# EAGLE design WZ4827R043-ESP32-V1.1-20230322 (EAGLE 9.5.1)
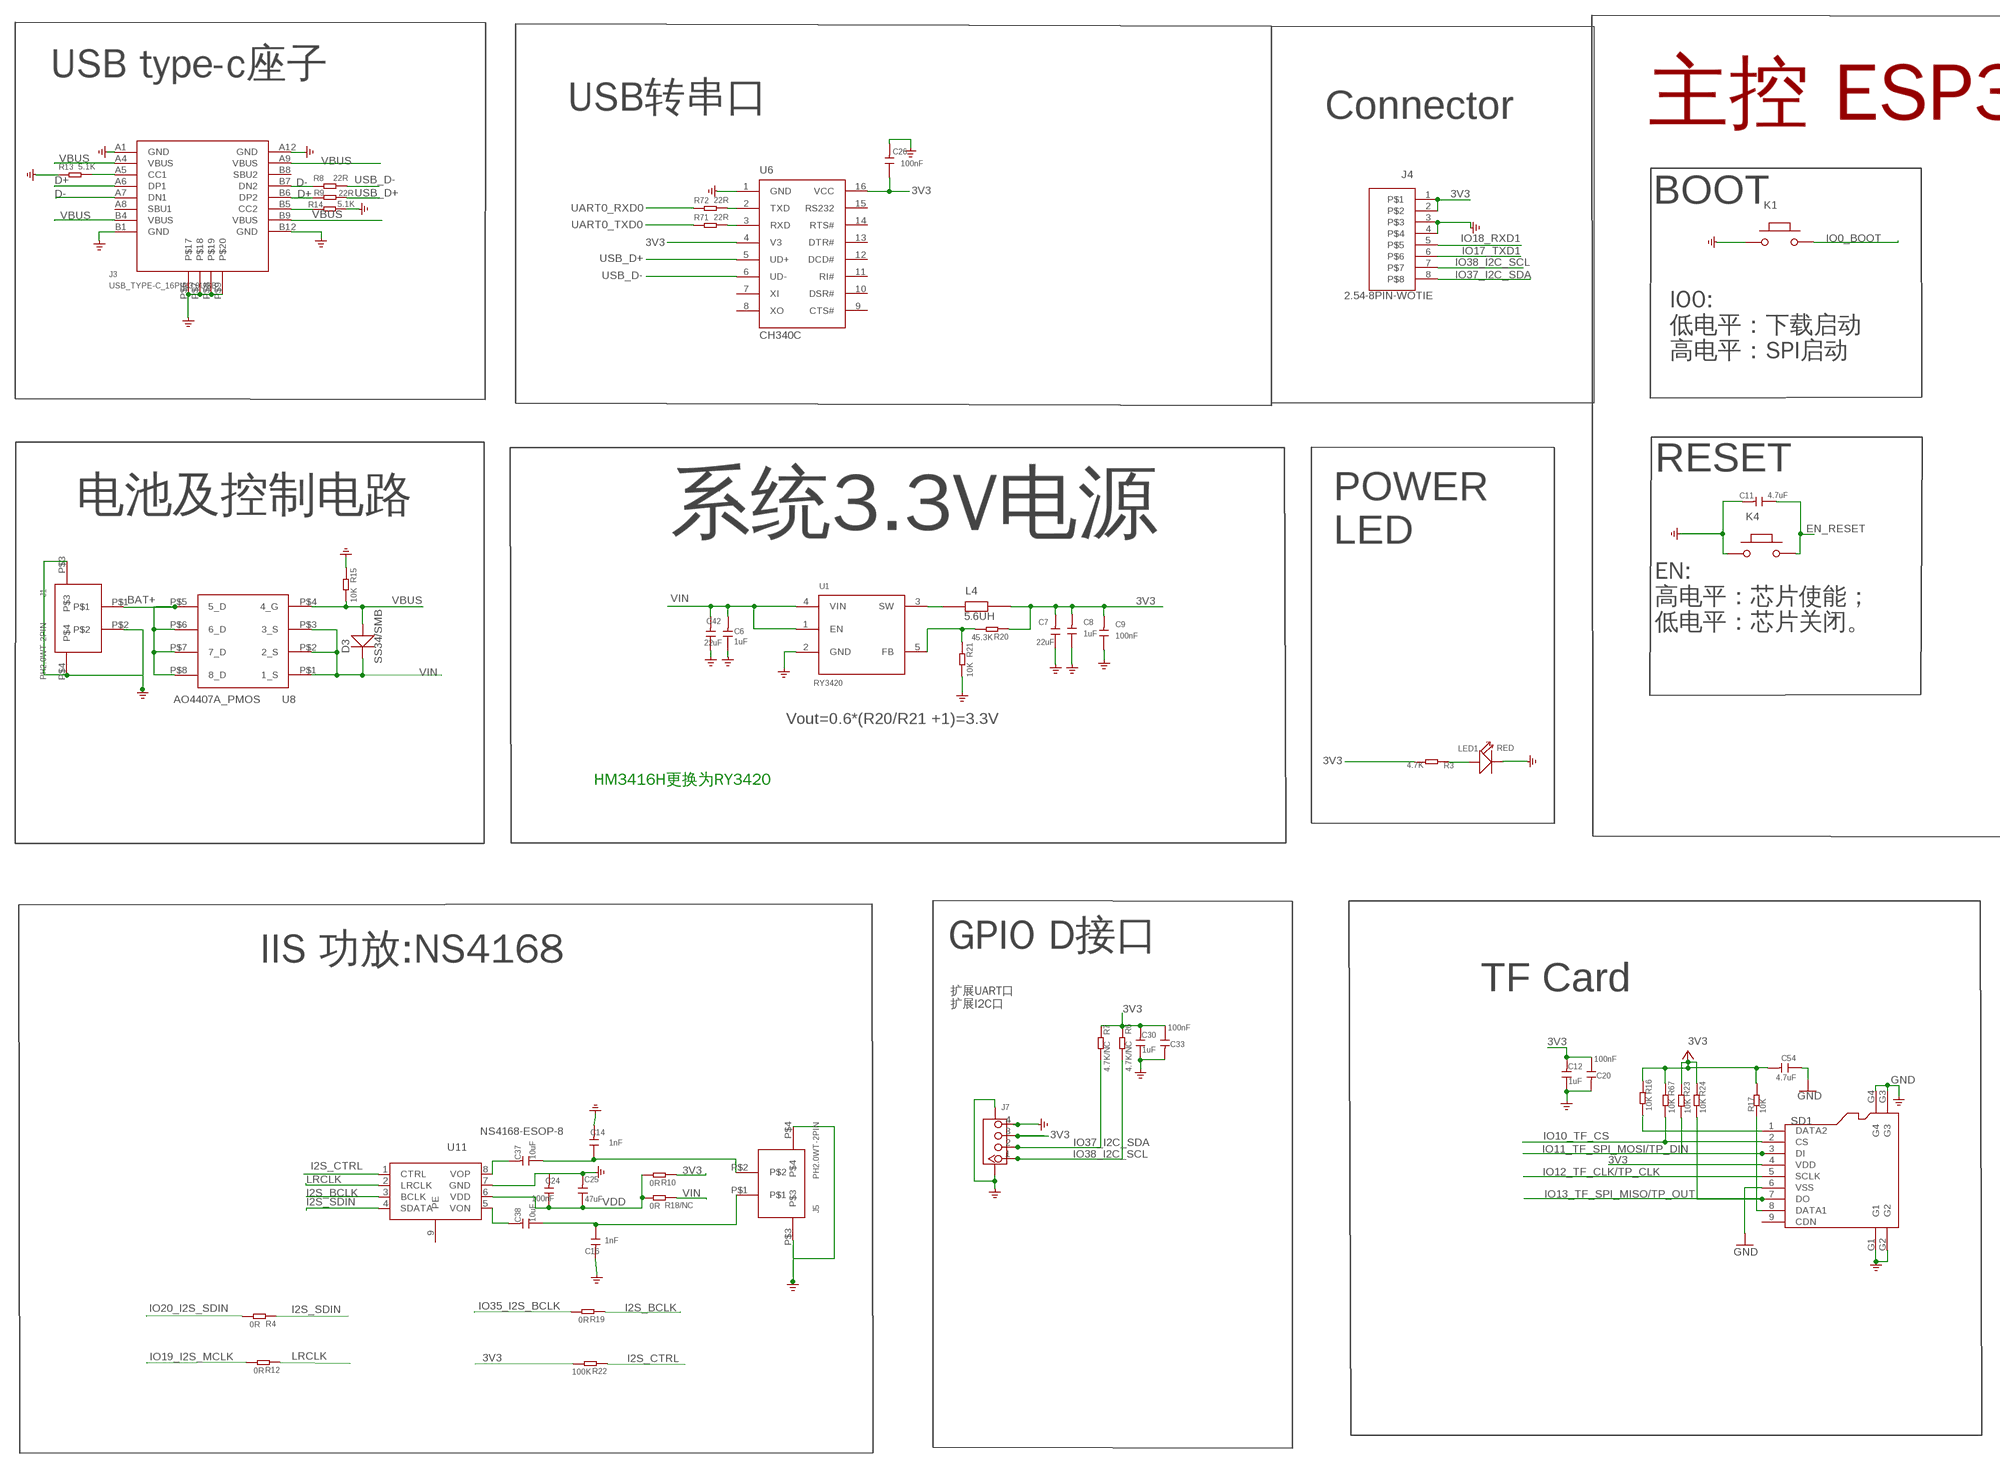
[diagram p0: schematic, sheet 1, part 1 of 2]
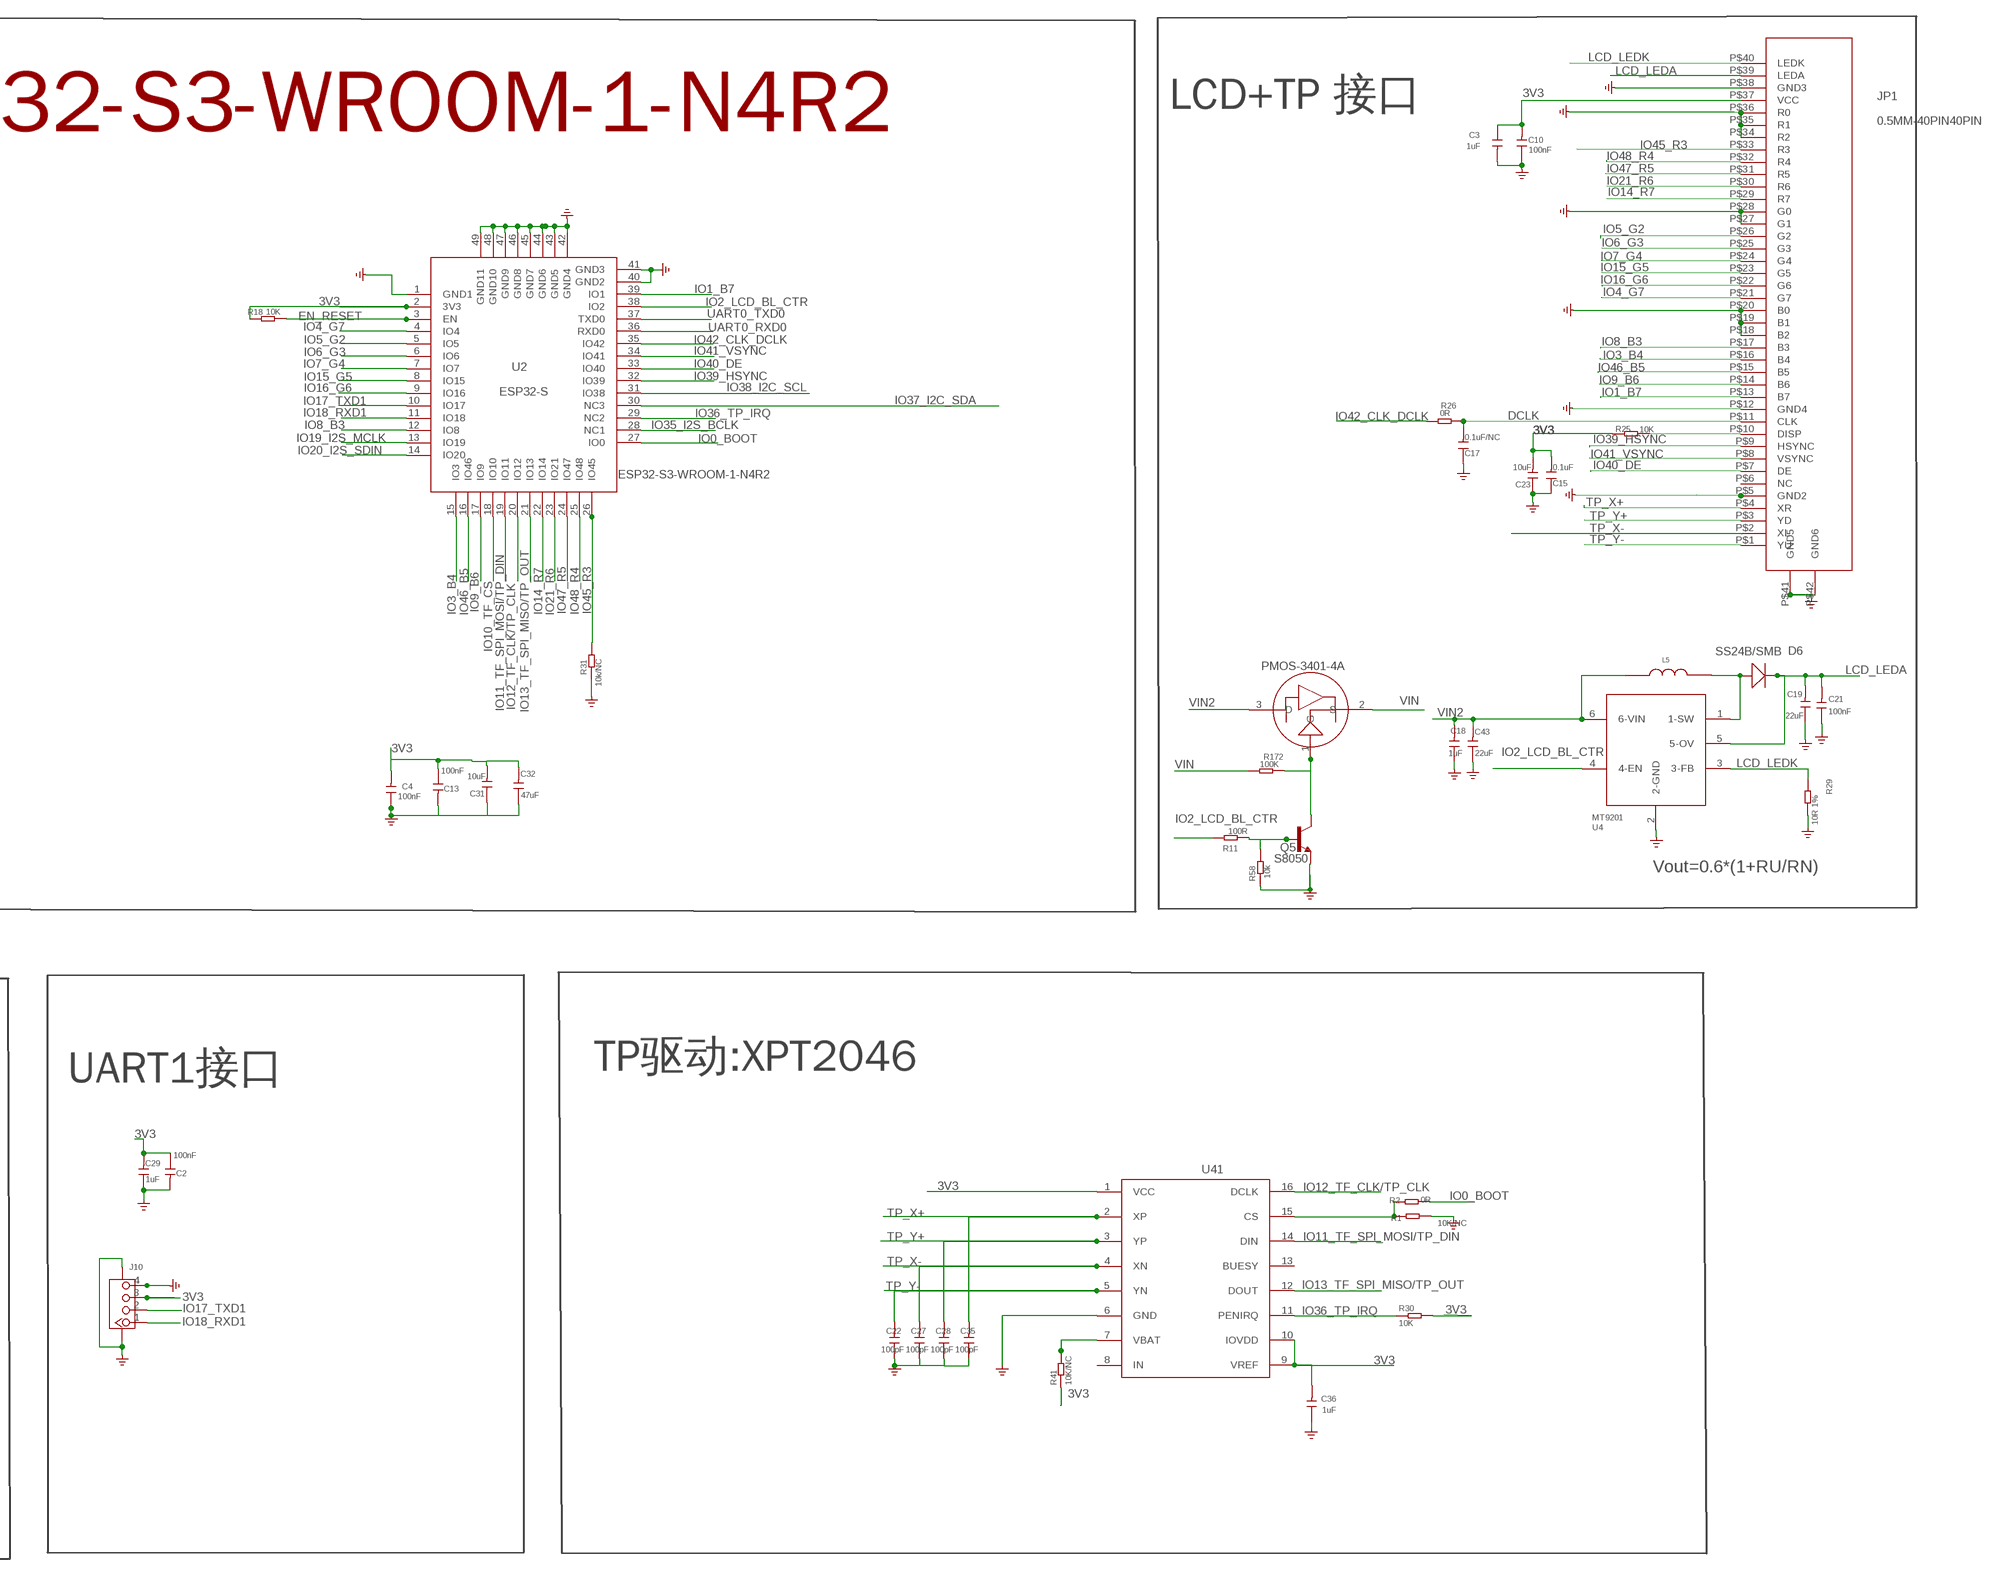
[diagram p1: schematic, sheet 1, part 2 of 2]

## Parts
C2  100nF  C-0603  [C0603]
C3  1uF  C-0603  [C0603]
C4  100nF  C-0603  [C0603]
C6  1uF  C0603  [0603]
C7  22uF  C0805  [0805]
C8  1uF  C0603  [0603]
C9  100nF  C0603  [0603]
C10  100nF  C-0603  [C0603]
C11  4.7uF  C0603  [0603]
C12  1uF  DISCRETE_C-0603  [DISCRETE_C0603]
C13  100nF  C-0603  [C0603]
C14  1nF  C-0603  [C0603]
C15  0.1uF  DISCRETE_C-0603  [DISCRETE_C0603]
C16  1nF  C-0603  [C0603]
C17  0.1uF/NC  DISCRETE_C-0603  [DISCRETE_C0603]
C18  1uF  C0603  [0603]
C19  22uF  C0805  [0805]
C20  100nF  C-0603  [C0603]
C21  100nF  C0603  [0603]
C22  100pF  C0603  [0603]
C23  10uF  DISCRETE_C-0603  [DISCRETE_C0603]
C24  100nF  C-0603  [C0603]
C25  47uF  C0805  [0805]
C26  100nF  C0603  [0603]
C27  100pF  C0603  [0603]
C28  100pF  C0603  [0603]
C29  1uF  DISCRETE_C-0603  [DISCRETE_C0603]
C30  1uF  DISCRETE_C-0603  [DISCRETE_C0603]
C31  10uF  DISCRETE_C-0603  [DISCRETE_C0603]
C32  47uF  C0805  [0805]
C33  100nF  C-0603  [C0603]
C35  100pF  C0603  [0603]
C36  1uF  DISCRETE_C-0603  [DISCRETE_C0603]
C37  10uF  DISCRETE_C-0603  [DISCRETE_C0603]
C38  10uF  DISCRETE_C-0603  [DISCRETE_C0603]
C42  22uF  C0805  [0805]
C43  22uF  C0805  [0805]
C54  4.7uF  DISCRETE_C-0603  [DISCRETE_C0603]
D3  SS34/SMB  214ABDO-214AB  [214AB]
D6  SS24B/SMB  214ABDO-214AB  [214AB]
J1  PH2.0WT-2PIN  [PH2.0WT-2PIN]
J3  USB_TYPE-C_16PIN3.0USB  [KEVIN_3.0TYPEC-SMD]
J4  2.54-8PIN-WOTIE  [2.54-8P-WOTIE]
J5  PH2.0WT-2PIN  [PH2.0WT-2PIN]
J7  CONNECTOR_TWIG-4P-2.0-SMD-FEMALE-REINFORCE90D  [CONNECTOR_4P-SMD-2.0-90D]
J10  CONNECTOR_TWIG-4P-2.0-SMD-FEMALE-REINFORCE90D  [CONNECTOR_4P-SMD-2.0-90D]
JP1  0.5MM-40PIN40PIN  [0.5MM*40P]
K1  BUTTON  PB157  [157SW]
K4  BUTTON  PB157  [157SW]
L4  5.6UH  CROWPI2-MB-V1.4-20211012_CMP201209UD1R0MT  [CD54]
L5  CD32_6.8uH  CD32_950MA  [CD32]
LED1  RED  DISCRETE_LED0603  [DISCRETE_LED-0603]
Q5  S8050  SPARKFUN_TRANSISTOR_NPNSOT23  [SPARKFUN_SOT23]
Q30  PMOS-3401-4A  P-MOS-SOT23  [SOT-23]
R1  10K/NC  R0603  [R0603]
R2  0R  DISCRETE_R-0603  [DISCRETE_R0603]
R3  4.7K  DISCRETE_R-0603  [DISCRETE_R0603]
R4  0R  DISCRETE_R-0603  [DISCRETE_R0603]
R6  4.7K/NC  DISCRETE_R-0603  [DISCRETE_R0603]
R7  4.7K/NC  DISCRETE_R-0603  [DISCRETE_R0603]
R8  22R  DISCRETE_R-0603  [DISCRETE_R0603]
R9  22R  DISCRETE_R-0603  [DISCRETE_R0603]
R10  0R  DISCRETE_R-0603  [DISCRETE_R0603]
R11  100R  R0603  [R0603]
R12  0R  DISCRETE_R-0603  [DISCRETE_R0603]
R13  5.1K  DISCRETE_R-0603  [DISCRETE_R0603]
R14  5.1K  DISCRETE_R-0603  [DISCRETE_R0603]
R15  10K  DISCRETE_R-0603  [DISCRETE_R0603]
R16  10K  DISCRETE_R-0603  [DISCRETE_R0603]
R17  10K  DISCRETE_R-0603  [DISCRETE_R0603]
R18  10K  DISCRETE_R-0603  [DISCRETE_R0603]
R18/NC  0R  DISCRETE_R-0603  [DISCRETE_R0603]
R19  0R  DISCRETE_R-0603  [DISCRETE_R0603]
R20  45.3K  DISCRETE_R-0603  [DISCRETE_R0603]
R21  10K  DISCRETE_R-0603  [DISCRETE_R0603]
R22  100K  DISCRETE_R-0603  [DISCRETE_R0603]
R23  10K  DISCRETE_R-0603  [DISCRETE_R0603]
R24  10K  DISCRETE_R-0603  [DISCRETE_R0603]
R25  10K  DISCRETE_R-0603  [DISCRETE_R0603]
R26  0R  R-0603  [R0603]
R29  10R 1%  DISCRETE_R-0603  [DISCRETE_R0603]
R30  10K  DISCRETE_R-0603  [DISCRETE_R0603]
R31  10k/NC  R0603  [R0603]
R41  10K/NC  DISCRETE_R-0603  [DISCRETE_R0603]
R58  10k  R0603  [R0603]
R67  10K  DISCRETE_R-0603  [DISCRETE_R0603]
R71  22R  DISCRETE_R-0603  [DISCRETE_R0603]
R72  22R  DISCRETE_R-0603  [DISCRETE_R0603]
R172  100K  R-0603  [R0603]
SD1  HOLDER-MICROSD-9P  [9P-SMD-W/-RING]
U1  RY3420  A_XBJ_HM3420B  [A_XBJ_SOT23-5]
U2  ESP32-S  [ESP32-S3]
U4  MT9201  [SOT23-6]
U6  CH340C  CH340G  [SOP-16]
U8  AO4407A_PMOS  T_PMOS_AO4407A_SOP8  [SOP8]
U11  NS4168-ESOP-8  [NS4168-ESOP-8]
U41  XPT2046  XP2046  [XP2046-SSOP16]

## Nets
3V3: C2.1 C3.1 C4.2 C7.2 C8.2 C9.2 C10.2 C12.2 C13.1 C15.2 C20.1 C23.2 C26.1 C29.2 C30.2 C31.2 C32.2 C33.1 C36.2 C54.2 J4.1 J4.2 J7.3 J10.3 JP1.P$37(VCC) L4.2 R3.2 R6.1 R7.1 R10.1 R16.1 R17.1 R18.1 R20.1 R22.2 R23.1 R24.1 R25.1 R30.2 R41.1 R67.1 SD1.4(VDD) U2.2(3V3) U6.4(V3) U6.16(VCC) U41.1(VCC) U41.9(VREF) U41.10(IOVDD) ; supply symbol labelled +3V3
BAT+: J1.P$1 U8.P$5(5_D) U8.P$6(6_D) U8.P$7(7_D) U8.P$8(8_D)
D+: J3.A6(DP1) J3.B6(DP2) R9.1
D-: J3.A7(DN1) J3.B7(DN2) R8.1
DCLK: C17.2 JP1.P$11(CLK) R26.2
EN_RESET: C11.1 K4.2 R18.2 U2.3(EN)
GND: C2.2 C3.2 C4.1 C6.1 C7.1 C8.1 C9.1 C10.1 C11.2 C12.1 C13.2 C14.2 C15.1 C16.2 C17.1 C18.1 C19.1 C20.2 C21.1 C22.1 C23.1 C24.2 C25.2 C26.2 C27.1 C28.1 C29.1 C30.1 C31.1 C32.1 C33.2 C35.1 C36.1 C42.1 C43.1 C54.1 J1.P$2 J1.P$3 J1.P$4 J3.A1(GND) J3.A12(GND) J3.B1(GND) J3.B12(GND) J3.P$6 J3.P$7 J3.P$8 J3.P$9 J4.3 J4.4 J5.P$3 J5.P$4 J7.4 J7.SS1 J7.SS2 J10.4 J10.SS1 J10.SS2 JP1.P$5(GND2) JP1.P$12(GND4) JP1.P$18(B2) JP1.P$19(B1) JP1.P$20(B0) JP1.P$27(G1) JP1.P$28(G0) JP1.P$34(R2) JP1.P$35(R1) JP1.P$36(R0) JP1.P$38(GND3) JP1.P$41(GND5) JP1.P$42(GND6) K1.1 K4.1 LED1.- Q5.2(E) R1.1 R13.1 R14.2 R15.1 R21.2 R29.2 R31.1 R58.1 SD1.6(VSS) SD1.G1 SD1.G2 SD1.G3 SD1.G4 U1.2(GND) U2.1(GND1) U2.40(GND2) U2.41(GND3) U2.42(GND4) U2.43(GND5) U2.44(GND6) U2.45(GND7) U2.46(GND8) U2.47(GND9) U2.48(GND10) U2.49(GND11) U4.2(2-GND) U6.1(GND) U11.7(GND) U41.6(GND)
I2S_BCLK: R19.1 U11.3(BCLK)
I2S_CTRL: R22.1 U11.1(CTRL)
I2S_SDIN: R4.1 U11.4(SDATA)
IO0_BOOT: K1.2 R2.1 U2.27(IO0)
IO1_B7: JP1.P$13(B7) U2.39(IO1)
IO2_LCD_BL_CTR: R11.2 U2.38(IO2) U4.4(4-EN)
IO3_B4: JP1.P$16(B4) U2.15(IO3)
IO4_G7: JP1.P$21(G7) U2.4(IO4)
IO5_G2: JP1.P$26(G2) U2.5(IO5)
IO6_G3: JP1.P$25(G3) U2.6(IO6)
IO7_G4: JP1.P$24(G4) U2.7(IO7)
IO8_B3: JP1.P$17(B3) U2.12(IO8)
IO9_B6: JP1.P$14(B6) U2.17(IO9)
IO10_TF_CS: R67.2 SD1.2(CS) U2.18(IO10)
IO11_TF_SPI_MOSI/TP_DIN: R23.2 SD1.3(DI) U2.19(IO11) U41.14(DIN)
IO12_TF_CLK/TP_CLK: SD1.5(SCLK) U2.20(IO12) U41.16(DCLK)
IO13_TF_SPI_MISO/TP_OUT: R24.2 SD1.7(DO) U2.21(IO13) U41.12(DOUT)
IO14_R7: JP1.P$29(R7) U2.22(IO14)
IO15_G5: JP1.P$23(G5) U2.8(IO15)
IO16_G6: JP1.P$22(G6) U2.9(IO16)
IO17_TXD1: J4.6 J10.2 U2.10(IO17)
IO18_RXD1: J4.5 J10.1 U2.11(IO18)
IO19_I2S_MCLK: R12.2 U2.13(IO19)
IO20_I2S_SDIN: R4.2 U2.14(IO20)
IO21_R6: JP1.P$30(R6) U2.23(IO21)
IO35_I2S_BCLK: R19.2 U2.28(NC1)
IO36_TP_IRQ: R30.1 U2.29(NC2) U41.11(PENIRQ)
IO37_I2C_SDA: J4.8 J7.2 R7.2 U2.30(NC3)
IO38_I2C_SCL: J4.7 J7.1 R6.2 U2.31(IO38)
IO39_HSYNC: JP1.P$9(HSYNC) U2.32(IO39)
IO40_DE: JP1.P$7(DE) U2.33(IO40)
IO41_VSYNC: JP1.P$8(VSYNC) U2.34(IO41)
IO42_CLK_DCLK: R26.1 U2.35(IO42)
IO45_R3: JP1.P$33(R3) R31.2 U2.26(IO45)
IO46_B5: JP1.P$15(B5) U2.16(IO46)
IO47_R5: JP1.P$31(R5) U2.24(IO47)
IO48_R4: JP1.P$32(R4) U2.25(IO48)
LCD_LEDA: C19.2 C21.2 D6.2(-) JP1.P$39(LEDA) U4.5(5-OV)
LCD_LEDK: JP1.P$40(LEDK) R29.1 U4.3(3-FB)
LRCLK: R12.1 U11.2(LRCLK)
N$1: LED1.+ R3.1
N$2: R41.2 U41.7(VBAT)
N$3: C37.2 U11.8(VOP)
N$6: C14.1 C37.1 J5.P$2
N$7: JP1.P$10(DISP) R25.2
N$9: R1.2 R2.2 U41.15(CS)
N$10: C16.1 C38.1 J5.P$1
N$11: J3.A5(CC1) R13.2
N$12: C38.2 U11.5(VON)
N$13: L4.1 U1.3(SW)
N$16: D6.1(+) L5.2 U4.1(1-SW)
N$17: J3.B5(CC2) R14.1
N$20: R20.2 R21.1 U1.5(FB)
N$23: Q5.1(B) R11.1 R58.2
N$36: Q5.3(C) Q30.1(G) R172.2
N$40: R72.2 U6.2(TXD)
N$42: R71.2 U6.3(RXD)
N$47: R16.2 SD1.1(DATA2)
N$48: R17.2 SD1.8(DATA1)
TP_X+: C35.2 JP1.P$4(XR) U41.2(XP)
TP_X-: C27.2 JP1.P$2(XL) U41.4(XN)
TP_Y+: C28.2 JP1.P$3(YD) U41.3(YP)
TP_Y-: C22.2 JP1.P$1(YU) U41.5(YN)
UART0_RXD0: R72.1 U2.36(RXD0)
UART0_TXD0: R71.1 U2.37(TXD0)
USB_D+: R9.2 U6.5(UD+)
USB_D-: R8.2 U6.6(UD-)
VBUS: D3.1(+) J3.A4(VBUS) J3.A9(VBUS) J3.B4(VBUS) J3.B9(VBUS) R15.2 U8.P$4(4_G)
VDD: C24.1 C25.1 R10.2 R18/NC.2 U11.6(VDD)
VIN: C6.2 C42.2 D3.2(-) Q30.2(S) R18/NC.1 R172.1 U1.1(EN) U1.4(VIN) U8.P$1(1_S) U8.P$2(2_S) U8.P$3(3_S)
VIN2: C18.2 C43.2 L5.1 Q30.3(D) U4.6(6-VIN)
Unconnected: J3.A8(SBU1) J3.B8(SBU2) JP1.P$6(NC) SD1.9(CDN) U6.7(XI) U6.8(XO) U6.9(CTS#) U6.10(DSR#) U6.11(RI#) U6.12(DCD#) U6.13(DTR#) U6.14(RTS#) U6.15(RS232) U11.9(PE) U41.8(IN) U41.13(BUESY)

## Notes on the sheet
- USB type-c座子
- USB转串口 | LCD+TP 接口
- Connector | 主控 ESP32-S3-WROOM-1-N4R2
- BOOT
- IO0:
  低电平：下载启动
  高电平：SPI启动
- RESET
- 电池及控制电路
- 系统3.3V电源
- POWER
  LED
- EN:
  高电平：芯片使能；
  低电平：芯片关闭。
- Vout=0.6*(R20/R21 +1)=3.3V
- HM3416H更换为RY3420
- Vout=0.6*(1+RU/RN)
- GPIO D接口
- IIS 功放:NS4168
- TF Card | UART1接口 | TP驱动:XPT2046
- 扩展UART口
  扩展I2C口

## Library data of the parts
C2-C4 C10 C13 C14 C16 C20 C24 C33 = discrete:C*: Ceramic Capacitors
C6 C8 C9 C11 C18 C21 C22 C26-C28 C35 = A_xbj:C0603
C7 C19 C25 C32 C42 C43 = A_xbj:C0805
C12 C29 C30 C36-C38 = A_xbj:DISCRETE_C*: Ceramic Capacitors
C15 C17 C23 C31 C54 = A9G:DISCRETE_C*: Ceramic Capacitors
D3 D6 = DO-214AB:214AB: 214AB
J1 J5 = cooper:PH2.0WT-2PIN
J3 = WZ3532R024-ESP32-V0.1-20221226:USB_TYPE-C_16PIN
J4 = cooper:2.54-8PIN-WOTIE
J7 J10 = A_xbj:CONNECTOR_TWIG-4P-2.0-SMD-FEMALE-REINFORCE
JP1 = cooper:0.5MM-40PIN
K1 K4 = MySMD:PB157
L4 = CD54:CROWPI2-MB-V1.4-20211012_CMP201209UD1R0MT
L5 = CD54:CD32_950MA
LED1 = A_xbj:DISCRETE_LED*
Q5 = Adafruit_HUZZAH32_ESP32_Feather:SPARKFUN_TRANSISTOR_NPN: Transistor NPN BJT configuration in SOT23 package. MMBT2222 is the common NPN we use. Double check BCE configuration again layout.
Q30 = DFN8:P-MOS-SOT23
R1 R11 R31 R58 = cooper:R0603
R2-R4 R6-R10 R12-R18 R18/NC R19-R25 R29 R67 R71 R72 = Crowtail-_LED-V2.0-20190615-01:DISCRETE_R*
R26 R172 = discrete:R*
R30 R41 = A9G:DISCRETE_R*
SD1 = Connector:HOLDER-MICROSD-9P
U1 = CrowBot_-V1.0-20220525:A_XBJ_HM3420B
U2 = DW1000:ESP32-S; U2: ESP32-S3-WROOM-1-N4R2
U4 = cooper:MT9201
U6 = A_xbj:CH340G
U8 = cooper:T_PMOS_AO4407A_SOP8
U11 = STC_MCUSTC8G1K08A:NS4168-ESOP-8
U41 = cooper:XP2046

## Net classes
0 GND: width 0.152 mm, drill 0.3 mm, clearance 0.152 mm

## Board
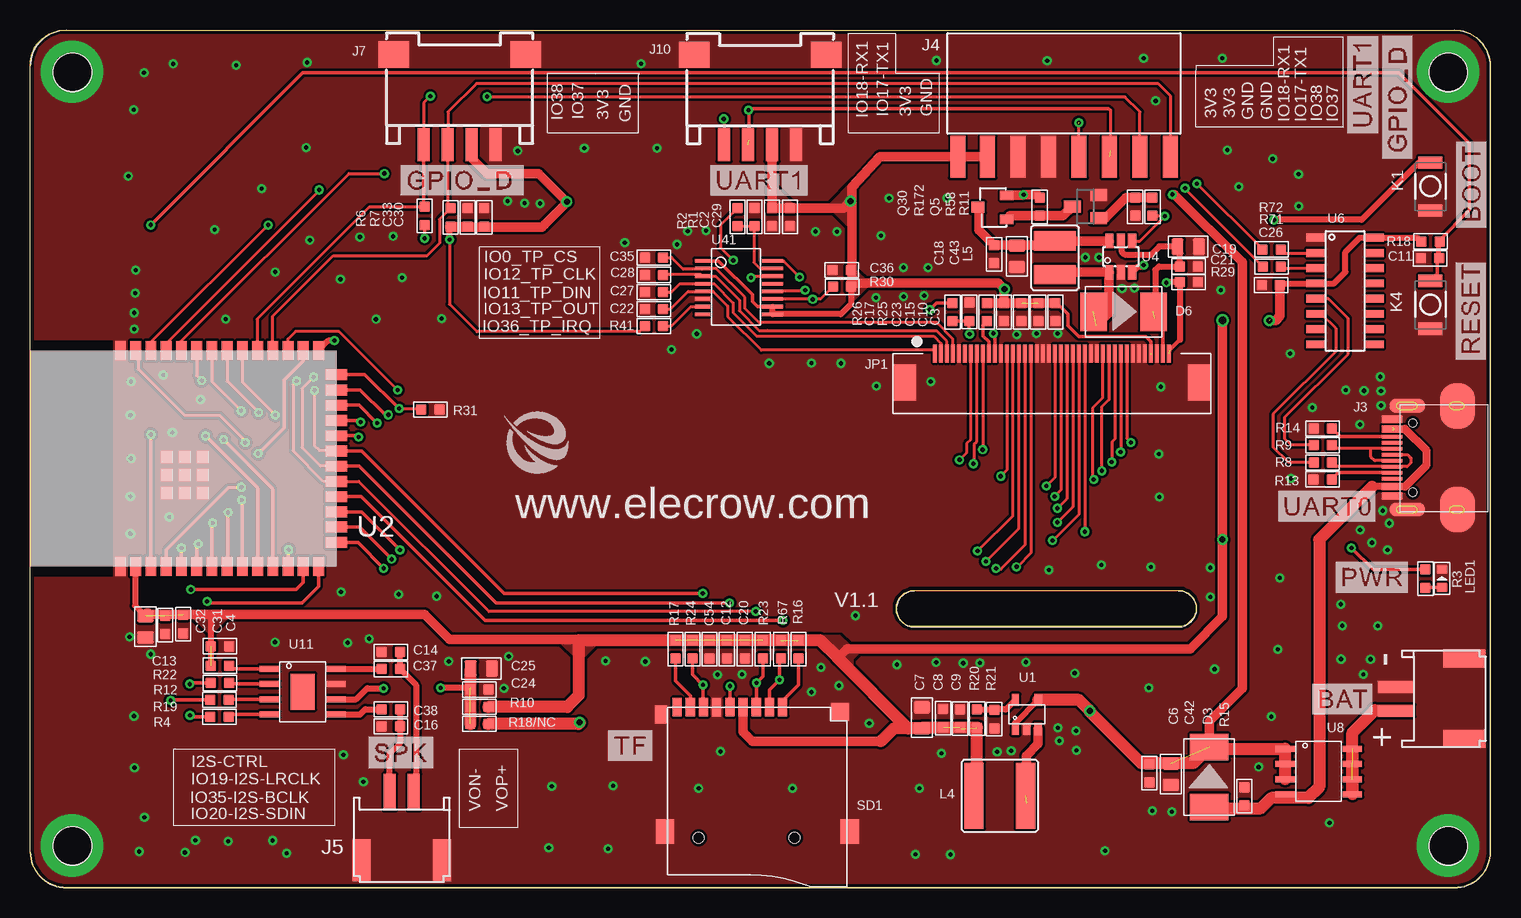
[diagram p2: board, top side]
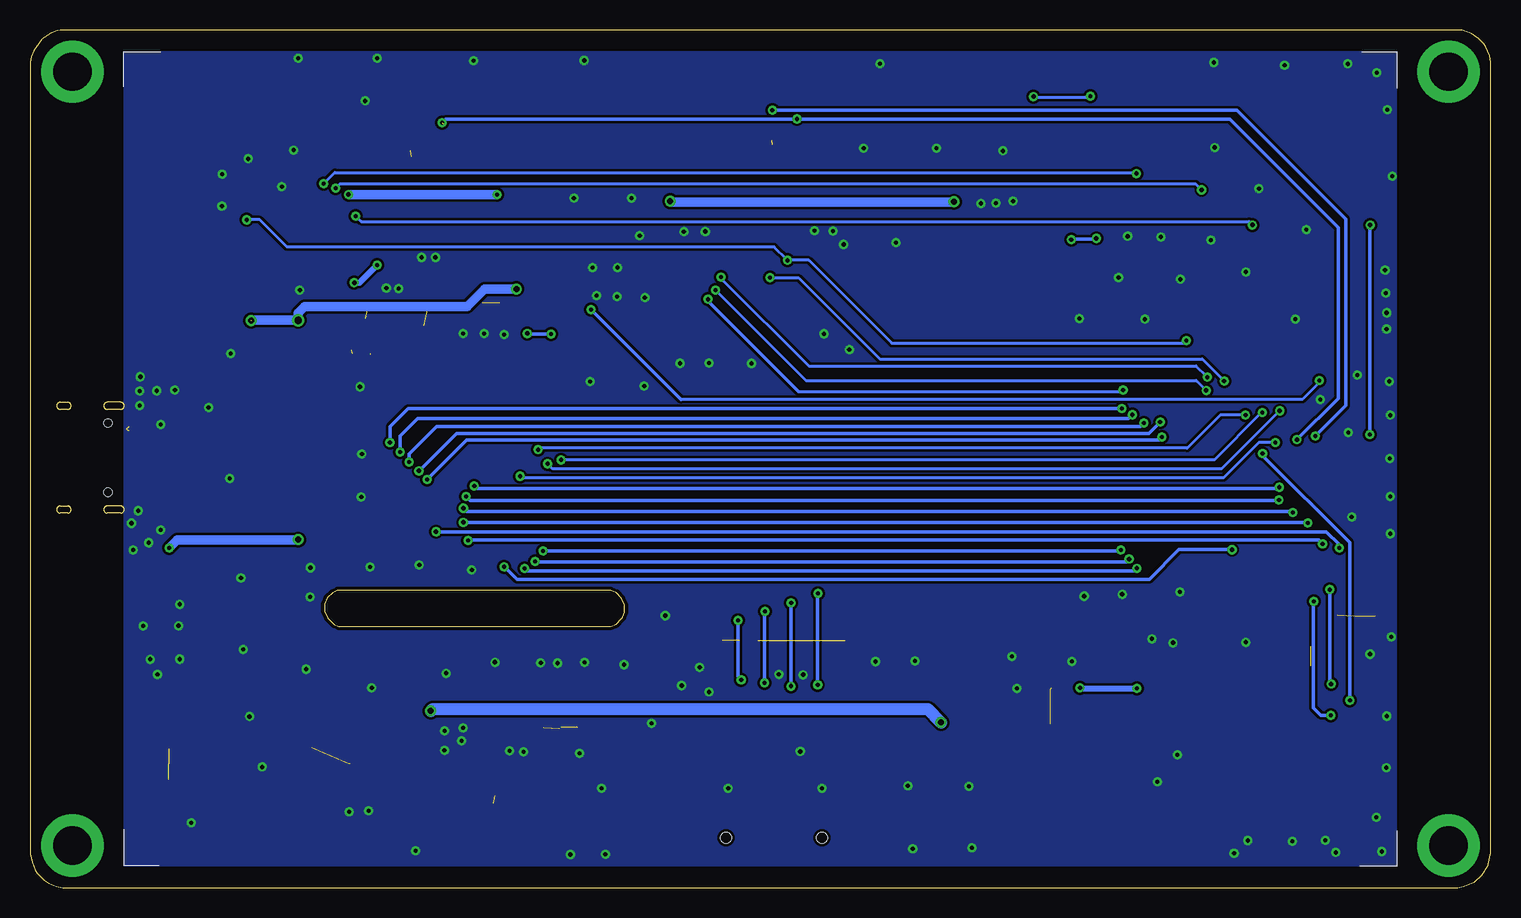
[diagram p3: board, bottom side, seen from below]

Size 121.74 x 71.5 mm. Coordinates in mm from the lower left corner, seen from the top.
Outline: 0,2.9 0,68.83 0.1,69.36 0.41,70.1 0.58,70.36 1.01,70.79 1.59,71.17 2.38,71.5 119.25,71.5 119.51,71.45 120.04,71.23 120.78,70.74 120.85,70.66 121.46,69.76 121.65,69.29 121.74,68.83 121.74,2.82 121.6,2.09 121.33,1.46 121.16,1.19 120.57,0.61 120.21,0.37 119.58,0.11 119.05,0 2.77,0 2.24,0.11 1.32,0.49 0.76,1.04 0.23,1.84 0.19,1.92 0,2.9
Outline: 96.03,21.77 73.36,21.77 72.92,21.95 72.49,22.38 72.38,22.54 72.21,22.95 72.21,23.55 72.44,24.1 72.89,24.56 73.4,24.76 96.11,24.76 96.55,24.58 97,24.14 97.21,23.63 97.21,23.03 96.98,22.48 96.43,21.93 96.03,21.77
Copper layers (1*16): Top 0.035mm / dielectric 1.5mm / Bottom 0.035mm
Design rules "default *": minimum track width 6mil, minimum drill 0.35mm, track to track 8mil, track to pad 7mil, pad to pad 7mil, via to via 8mil, smd to smd 8mil, copper to edge 10mil, drill to drill 8mil, minimum pad ring 10mil, minimum via ring 8mil, stop-mask expansion 4mil, vias tented up to drill 100mil, thermal gap 0mil

### Footprints (pad centres in the part's own frame; a part is rotated, then mirrored left to right if it is on the bottom)
C0603 = smd 0.889 x 0.889: 1 -0.762,0; 2 0.762,0
0603 = smd 0.889 x 0.889: 1 -0.762,0; 2 0.762,0
0805 = smd 1.016 x 1.397: 1 -0.889,0; 2 0.889,0
DISCRETE_C0603 = smd 0.889 x 0.889: 1 -0.762,0; 2 0.762,0
214AB = smd 2.2 x 3.2: 1 -2.5,0; 2 2.5,0
PH2.0WT-2PIN = smd 1 x 3: P$1 -1,0; P$2 1,0 | smd 1.5 x 3.5: P$3 -3.35,-5.7; P$4 3.35,-5.7
KEVIN_3.0TYPEC-SMD = smd 0.3 x 1.7: A1 -3.35,0.5; A4 -2.55,0.5; A5 -1.25,0.5; A6 -0.25,0.5; A7 0.25,0.5; A8 1.25,0.5; A9 2.55,0.5; A12 3.35,0.5; B1 3.05,0.5; B4 2.25,0.5; B5 1.75,0.5; B6 0.75,0.5; B7 -0.75,0.5; B8 -1.75,0.5; B9 -2.25,0.5; B12 -3.05,0.5 | smd 1.143 x 2.921: P$6 -4.318,-0.762; P$7 4.318,-0.762 | smd 3.81 x 2.921: P$8 -4.318,-4.953; P$9 4.318,-4.953 | hole 0.68: -2.89,-1.22; 2.89,-1.22
2.54-8P-WOTIE = smd 1.25 x 3.5: 1 -8.839,-4.572; 2 -6.35,-4.572; 3 -3.81,-4.572; 4 -1.27,-4.572; 5 1.27,-4.572; 6 3.81,-4.572; 7 6.35,-4.572; 8 8.89,-4.572
CONNECTOR_4P-SMD-2.0-90D = smd 1.01 x 2.74: 1 -3,-0.1; 2 -1,-0.1; 3 1,-0.1; 4 3,-0.1 | smd 2.54 x 2.184: SS1 -5.5,7.4; SS2 5.5,7.4
0.5MM*40P = smd 0.3 x 1.5: P$1 -8.81,1.73; P$2 -8.31,1.73; P$3 -7.81,1.73; P$4 -7.31,1.73; P$5 -6.81,1.73; P$6 -6.31,1.73; P$7 -5.81,1.73; P$8 -5.31,1.73; P$9 -4.81,1.73; P$10 -4.31,1.73; P$11 -3.81,1.73; P$12 -3.31,1.73; P$13 -2.81,1.73; P$14 -2.31,1.73; P$15 -1.81,1.73; P$16 -1.31,1.73; P$17 -0.81,1.73; P$18 -0.31,1.73; P$19 0.19,1.73; P$20 0.69,1.73; P$21 1.19,1.73; P$22 1.69,1.73; P$23 2.19,1.73; P$24 2.69,1.73; P$25 3.19,1.73; P$26 3.69,1.73; P$27 4.19,1.73; P$28 4.69,1.73; P$29 5.19,1.73; P$30 5.69,1.73; P$31 6.19,1.73; P$32 6.69,1.73; P$33 7.19,1.73; P$34 7.69,1.73; P$35 8.19,1.73; P$36 8.69,1.73; P$37 9.19,1.73; P$38 9.69,1.73; P$39 10.19,1.73; P$40 10.69,1.73 | smd 1.8 x 3: P$41 -11.31,-0.67; P$42 13.19,-0.67
157SW = smd 1.016 x 1.981: 1 0,0; 2 4,0
CD54 = smd 5.5 x 1.6: 1 0,2.159; 2 0,-2.159
CD32 = smd 3.5 x 1.6: 1 0,1.409; 2 0,-1.409
DISCRETE_LED-0603 = smd 0.762 x 0.889: + -0.762,0; - 0.762,0
SPARKFUN_SOT23 = smd 1 x 1.4: 1 -0.95,-1.1; 2 0.95,-1.1; 3 0,1.1
SOT-23 = smd 1.1 x 0.8: 1 1.2,-1; 2 1.2,1 | smd 1.1 x 0.9: 3 -1.2,0
R0603 = smd 0.889 x 0.889: 1 -0.762,0; 2 0.762,0
DISCRETE_R0603 = smd 0.889 x 0.889: 1 -0.762,0; 2 0.762,0
9P-SMD-W/-RING = smd 1.524 x 0.762: 1 0,4.4; 2 0,3.3; 3 0,2.2; 4 0,1.1; 5 0,0; 6 0,-1.1; 7 0,-2.2; 8 0,-3.3; 9 0,-4.4 | smd 1.524 x 1.016: G1 0.6,-5.746 | smd 2.032 x 1.524: G2 10.373,-5.4; G3 10.373,10 | smd 1.524 x 1.524: G4 0.392,9.181 | hole 0.889: 10.9,-2.6; 10.9,5.4
A_XBJ_SOT23-5 = smd 0.6 x 1: 1 -0.95,-1.2; 2 0,-1.2; 3 0.95,-1.2; 4 0.95,1.2; 5 -0.95,1.2
ESP32-S3 = smd 1.6 x 0.9: 1 0,18.01; 2 0,16.74; 3 0,15.47; 4 0,14.2; 5 0,12.93; 6 0,11.66; 7 0,10.39; 8 0,9.12; 9 0,7.85; 10 0,6.58; 11 0,5.31; 12 0,4.04; 13 0,2.77; 14 0,1.5; 27 18,1.5; 28 18,2.77; 29 18,4.04; 30 18,5.31; 31 18,6.58; 32 18,7.85; 33 18,9.12; 34 18,10.39; 35 18,11.66; 36 18,12.93; 37 18,14.2; 38 18,15.47; 39 18,16.74; 40 18,18.01 | smd 0.9 x 1.8: 15 2,0; 16 3.28,0; 17 4.55,0; 18 5.82,0; 19 7.09,0; 20 8.36,0; 21 9.63,0; 22 10.9,0; 23 12.17,0; 24 13.44,0; 25 14.71,0; 26 16,0 | smd 1 x 1: 41 7.64,11.16; 42 9.14,11.16; 43 6.14,11.16; 44 6.14,14.16; 45 7.64,12.66; 46 9.14,12.66; 47 7.64,14.16; 48 9.14,14.16; 49 6.14,12.66
SOT23-6 = smd 0.69 x 1.2: 1 -0.95,-1.3; 2 0,-1.3; 3 0.95,-1.3; 4 0.95,1.3; 5 0,1.3; 6 -0.95,1.3
SOP-16 = smd 0.66 x 1.5: 1 -4.445,-2.475; 2 -3.175,-2.475; 3 -1.905,-2.475; 4 -0.635,-2.475; 5 0.635,-2.475; 6 1.905,-2.475; 7 3.175,-2.475; 8 4.445,-2.475; 9 4.445,2.475; 10 3.175,2.475; 11 1.905,2.475; 12 0.635,2.475; 13 -0.635,2.475; 14 -1.905,2.475; 15 -3.175,2.475; 16 -4.445,2.475
SOP8 = smd 0.5 x 1.6: P$1 -1.905,-2.8; P$2 -0.635,-2.8; P$3 0.635,-2.8; P$4 1.905,-2.8; P$5 1.905,2.8; P$6 0.635,2.8; P$7 -0.635,2.8; P$8 -1.905,2.8
NS4168-ESOP-8 = smd 1.6 x 0.5: 1 -2.8,1.905; 2 -2.8,0.635; 3 -2.8,-0.635; 4 -2.8,-1.905; 5 2.8,-1.905; 6 2.8,-0.635; 7 2.8,0.635; 8 2.8,1.905 | smd 2 x 3: 9 0,0
XP2046-SSOP16 = smd 0.305 x 1.27: 1 -2.54,-2.54; 2 -1.905,-2.54; 3 -1.27,-2.54; 4 -0.635,-2.54; 5 0,-2.54; 6 0.635,-2.54; 7 1.27,-2.54; 8 1.905,-2.54 | smd 0.305 x 1.778: 9 1.905,3.302; 10 1.27,3.302; 11 0.635,3.302; 12 0,3.302; 13 -0.635,3.302; 14 -1.27,3.302; 15 -1.905,3.302; 16 -2.54,3.302

### Placement (x,y rotation side)
C2  61.85,55.91 270 top
C3  85.47,47.98 270 top
C4  12.78,21.97 90 top
C6  93.32,9.53 90 top
C7  74.36,14.15 270 top
C8  76.12,14.13 270 top
C9  77.54,14.1 270 top
C10  84.05,47.98 90 top
C11  116.72,52.47 180 top
C12  58.09,19.86 90 top
C13  15.82,20.12 0 top
C14  30.07,19.63 180 top
C15  82.63,47.98 90 top
C16  30.07,13.44 180 top
C17  78.31,48.01 270 top
C18  80.37,52.81 90 top
C19  96.55,53.44 180 top
C20  59.59,19.86 270 top
C21  96.6,51.79 180 top
C22  52.02,48.23 0 top
C23  81.18,47.98 90 top
C24  37.46,16.51 0 top
C25  37.62,18.26 0 top
C26  103.44,50.23 180 top
C27  52.02,49.66 0 top
C28  52.02,51.08 0 top
C29  63.35,55.91 90 top
C30  37.87,55.88 270 top
C31  11.28,21.89 90 top
C32  9.63,21.74 90 top
C33  36.47,55.88 90 top
C35  52.02,52.53 0 top
C36  67.67,51.49 0 top
C37  30.07,18.21 180 top
C38  30.07,14.86 180 top
C42  95.1,9.45 90 top
C43  82.27,52.63 90 top
C54  56.64,19.86 90 top
D3  98.3,9.21 90 top
D6  91.16,48.01 0 top
J1  113.87,15.75 90 top
J3  114.05,35.84 90 top
J4  86.18,65.51 0 top
J5  30.99,7.97 0 top
J7  35.81,62.05 0 top
J10  60.86,62.03 0 top
JP1  84.24,42.79 0 top
K1  116.74,56.44 90 top
K4  116.74,46.58 90 top
L4  80.85,7.65 270 top
L5  85.45,52.5 0 top
LED1  117.7,25.78 90 top
Q5  87.99,56.77 90 top
Q30  80.21,56.72 0 top
R1  60.4,55.91 270 top
R2  58.98,55.91 270 top
R3  116.33,25.76 90 top
R4  15.8,14.22 180 top
R6  32.89,56.01 90 top
R7  35.05,55.88 90 top
R8  107.76,35.44 180 top
R9  107.76,36.88 180 top
R10  37.46,15.06 180 top
R11  93.57,56.77 270 top
R12  15.82,17.04 180 top
R13  107.76,34.04 0 top
R14  107.76,38.27 180 top
R15  101.22,7.61 270 top
R16  64.06,19.86 270 top
R17  53.82,19.86 270 top
R18  116.74,53.87 0 top
R18/NC  37.46,13.64 180 top
R19  15.8,15.65 180 top
R20  78.96,14.08 90 top
R21  80.38,14.05 270 top
R22  15.82,18.49 180 top
R23  61.09,19.86 270 top
R24  55.22,19.86 270 top
R25  79.76,47.98 270 top
R26  76.91,47.98 270 top
R29  96.6,50.47 0 top
R30  67.69,50.09 0 top
R31  33.38,39.85 180 top
R41  52.02,46.81 0 top
R58  92.13,56.77 90 top
R67  62.61,19.86 270 top
R71  103.51,51.77 0 top
R72  103.49,53.2 0 top
R172  84.18,56.77 270 top
SD1  58.34,15.04 270 top
U1  83.09,14.43 0 top
U2  25.55,26.77 90 top
U4  90.93,52.6 0 top
U6  109.62,49.74 270 top
U8  107.43,9.68 270 top
U11  22.73,16.33 0 top
U41  58.6,49.71 270 top
U$10  [4.3底部丝印]  121.89,-0.05 0 bottom
U$30  [ELECROW-NEW]  39.45,34.52 0 top
U$33  [4.3板框]  -0.05,-0.28 0 top

### Tracks (layer width: path | path; a pad name or v marks a point on that pad's centre or on a via)
1
  cutout Top: 108.2,34.87 108.2,36.75 113.67,36.75 113.69,36.78 113.69,35.1 112.57,33.99 109.09,33.99
3V3  (via drill 0.35, 0.5, 0.6)  (14 unrouted)
  Top 0.152: C33.1 C30.2 | v44.75,57.18 44.75,57.12 42.9,55.27
  Top 0.203: 77.64,13.24 C9.2 77.51,13.37 | C8.2 76.14,13.34
  Top 0.254: v34.98,54.03 34.98,48.64 37.26,46.35 50.8,46.35 R41.1 | 115.67,54.18 R18.1 | R22.2 | 15.01,22.78 15.06,22.74 | C10.2 82.78,48.74 | R16.1 62.79,20.62
  Top 0.3: R3.2 111.96,26.52 v110.16,28.32 | JP1.P$37 93.43,44.6 93.43,44.61 | v34.98,54.03 34.98,55.07 | U41.1 57.4,52.25 60.22,49.42 60.22,48.87 60.65,48.44 U41.10 | C3.1 85.62,48.74 86.54,47.83 86.54,46.86 87.45,45.95 93.01,45.95 93.44,45.52 93.44,44.43 | SD1.4 59.44,13.76 | v32.89,54.13 R6.1
  Top 0.5: U2.2 8.76,26.72 8.76,23.49 C32.2 | R30.2 68.45,48.67 67.59,47.8 U41.9 U41.10 | v34.98,54.03 34.98,55.12 | C33.1 R7.1 | 115.67,54.18 U6.16 110.85,54.18 109.65,52.98 109.65,51.33 108.69,50.37 U6.4 104.35,50.37 C26.1 | 15.06,22.74 R22.2 | C2.1 C29.2
  Top 0.8: C26.1 104.2,47.64 103.83,47.27 v103.33,47.27 | C23.2 81.18,49.86 v81.23,49.91 80.75,50.39 68.76,50.39 R30.2 68.45,50.47 68.53,50.55 68.53,57.1 v68.4,57.23 | C23.2 R25.1 | C23.2 82.78,48.74 C3.1 85.48,48.73 | J10.3 61.85,61.92 C2.1 67.84,56.67 v68.4,57.23 | v68.4,57.23 68.53,57.35 68.53,58.4 70.85,60.93 J4.1 J4.2 | J7.3 36.75,61.89 36.75,60.86 38.1,59.51 42.39,59.51 44.77,57.14 42.9,55.27 42.7,55.07 34.98,55.07 | 70.93,12.19 60.25,12.19 59.44,13 SD1.4 | 67.34,19.13 68.12,19.91 96.72,19.91 99.42,22.61 v99.42,29.01 v99.42,47.29 | C33.1 34.98,55.12 | 9.78,22.78 15.01,22.78 32.88,22.78 34.96,20.7 45.82,20.7
  Top 1: L4.2 78.96,7.92 R20.1 74.41,13.31 C7.2 73.2,13.26 | 73.2,13.26 72,13.26 70.93,12.19 | 73.2,13.26 67.34,19.13 65.84,20.62 62.79,20.62 R17.1 45.75,20.62 45.75,16.03 44.78,15.06 R10.1 | C32.2 9.78,22.78
  Bottom 0.3: v103.33,47.27 103.33,47.37 | v32.89,54.13 32.97,54.05 34.98,54.05 v34.98,54.03
  Bottom 0.8: 103.38,47.29 v99.42,47.29 99.42,47.88 98.86,48.44 85.34,48.44 83.87,49.91 v81.23,49.91 | v110.16,28.32 109.5,28.98 99.44,28.98 v99.42,29.01 | v68.4,57.23 68.33,57.15 44.78,57.15 v44.75,57.18
  pour Top: 44.73,20.7 47.7,20.7 45.82,18.82 45.82,18.8 43.92,20.7
  pour Top: 13.97,22.91 16.94,22.91 15.06,21.03 15.06,21.01 13.16,22.91
  pour Top: 65.89,21.08 67.49,21.08 68.28,20.29 68.61,19.96 68.61,18.29 65.89,21.01 65.89,21.06
  pour Top (no thermals): 68.45,18.87 69.34,19.76 69.34,19.84 68.35,19.84 68.35,18.97
  pour Top (no thermals): 68.71,51.66 70.03,50.34 70.03,50.27 68.4,48.64 68.4,52.4 68.71,52.1
  pour Top (no thermals): 68.44,54.85 66.46,56.83 68.73,59.11 68.73,55.14
  pour Top: 63.25,56.57 62.15,56.57 62.15,58.47 64.06,56.57
BAT+  (2 unrouted)
  Top 1: U8.P$8 U8.P$5 110.23,12.91 112.1,14.78 J1.P$1
D+
  Top 0.254: J3.A6 112.11,35.59 111.79,35.92 111.79,36.59 | J3.B6 111.79,36.59 | 111.79,36.59 108.81,36.59 R9.1
D-
  Top 0.254: R8.1 108.88,35.09 J3.B7 114.79,35.09 115.11,35.41 115.11,35.81 114.84,36.09 J3.A7
DCLK  (via drill 0.35)
  Top 0.254: JP1.P$11 80.44,43.95
  Top 0.3: R26.2 76.94,47.24 C17.2 78.28,47.22 78.28,46.2 v78.33,46.15 | v80.31,46.2 80.44,46.08 80.44,43.95
  Bottom 0.3: v80.31,46.2 80.26,46.15 v78.33,46.15
EN_RESET  (via drill 0.35)
  Top 0.254: R18.2 117.33,53.7 | 117.33,53.8 117.33,53.7 | 117.33,53.7 117.33,52.2
  Top 0.3: U2.3 v10.08,37.77 | v10.06,55.24 22.73,67.92 114.12,67.92 119.99,62.05 119.99,56.46 117.48,53.95 | 117.48,53.95 C11.1 117.48,52.35 117.33,52.2 117.33,51.17 K4.2 | 117.48,53.95 117.33,53.8
  Bottom 0.3: v10.08,37.77 10.08,55.22 v10.06,55.24
GND  (via drill 0.35, 3.2 pad 5.2)
  Top 0.203: C42.1 94.71,8.95
  other vias: 118.22,68.03 3.51,68.03 3.51,3.51 118.22,3.51 74.87,51.68 31.02,50.84 105.77,56.8 93.43,26.74 12.92,2.92 89.62,3.06 16.3,47.39 68.82,22.67 76.73,2.75 70.95,54.36 76.43,57.49 8.64,64.86 75.54,18.78 93.28,16.65 25.87,50.72 110.87,38.6 55.74,8.27 8.3,20.89 99.41,69.16 49.59,53.77 8.2,59.3 8.68,47.92 93.55,6.39 102.42,10.05 9.1,3 8.71,10 98.4,26.67 28.84,47.38 27.79,8.81 65.48,54.71 109.7,41.47 56.37,54.77 73.81,2.77 98.41,24.23 92.83,69.14 99.28,49.81 82.26,46.1 8.67,14.3 113.32,30.37 72.26,18.59 19.32,58.28 71.62,57.49 77.79,18.71 53.94,53.63 109.29,19.04 23.1,68.79 46.21,61.64 85.67,46.19 40.66,61.42 43.5,8.44 57.32,17.75 75.97,11.2 84.79,68.95 23.01,61.7 109.39,21.83 47.99,18.89 43.25,3.32 67.27,54.68 105.05,44.53 72.8,51.7 57.56,11.34 51.29,18.83 74.14,8.27 79.19,18.72 106.89,40.02 84.95,26.49 50.93,68.7 108.33,5.39 34.3,47.45 39.82,57.24 28.26,20.75 112.34,21.81 87.09,17.87 54.83,54.72 20.42,20.45 83.91,46.19 94.11,36.15 59.35,17.77 109.28,23.62 8.81,51.47 26.13,11.07 10.06,19.46 89.32,26.89 98.75,18.21 105.75,59.47 112.63,41.39 103.59,60.76 63.57,8.27 20.24,3.92 48.6,8.49 94.16,32.56 105.13,34.1 112.76,31.41 95.18,6.31 13.79,3.93 83.02,18.79 11.93,68.67 9.54,5.85 33.9,24.29 30.73,24.45 75.57,68.96 26.49,20.41 9.51,67.94 17.19,68.57 21.4,2.85 52.28,61.66 16.53,3.84 69.96,13.68 87.2,13.07 87.23,11.44 80.62,11.32 81.79,11.39 8.37,29.5 8.37,32.6 8.42,35.77 8.37,39.38 8.45,42.2 89.12,52.54 91.04,49.95 92.06,49.98 23.33,53.97 20.43,51.33 42.51,57.04 27.5,54.25 15.39,54.86 30.27,54.3 41.24,57.06 65.94,18.36 65.16,16.3 67.44,16.83 34.91,18.86 39.91,19.27 39.5,16.6 85.68,13.32 85.8,12.23 103.48,14.26 104.01,19.85 104.19,25.81 113.16,28.14 110.88,29.82 111.87,28.75 112.63,40.2 111.21,41.42 112.57,42.59 93.84,65.59 99.8,61.49 48.19,3.23 14.21,40.68 11.12,42.73 11.88,37.93 11.6,30.9 25.92,24.65 111.75,19.04 111.15,17.77 65.16,43.73 67.6,43.71 8.76,49.57 8.69,46.57 53.47,44.85 70.57,41.8 87.97,52.54 55.58,46.17 61.63,43.71 100.78,58.44 94.27,41.75 75.09,42.18 70.52,49.19 72.83,49.26 74.54,49.34
  pour Top (rank 2): 0,72.26 127.18,72.26 127.18,0.08 127.1,0 126.7,-0.41 126.64,-0.41 0.03,-0.41 0,-0.38 0,25.91 6.98,25.91 6.98,45.64 0.1,45.64 0.05,45.59 0.05,72.21
  pour Bottom: 7.82,69.7 113.94,69.7 113.94,1.8 7.85,1.8 7.85,69.67
I2S_BCLK
  Top 0.3: U11.3 16.61,15.7 R19.1
I2S_CTRL
  Top 0.3: U11.1 16.84,18.24 R22.1
I2S_SDIN
  Top 0.3: U11.4 16.76,14.43 R4.1
IO0_BOOT  (via drill 0.35)
  Top 0.254: v58.62,52.3 57.56,53.37 57.56,55.24 R2.1
  Top 0.5: v25.37,45.59 24.87,45.59 U2.27 | K1.2 115.79,60.44 111.02,55.67 v103.7,55.67
  Bottom 0.254: v103.7,55.67 102.61,55.67 100.36,53.42 59.74,53.42 v58.62,52.3 56.84,52.3 49.94,45.39 25.58,45.39 v25.37,45.59
IO1_B7  (via drill 0.35)
  Top 0.254: v80.92,34.29 81.43,34.8 JP1.P$13 | U2.39 9.02,44.57 9.02,43.22 12.88,39.36 15.83,39.36 17.96,37.24 v17.96,37.11
  Bottom 0.254: v17.96,37.11 19.33,37.11 22.28,34.16 80.8,34.16 v80.92,34.29
IO2_LCD_BL_CTR  (via drill 0.35)
  Top 0.254: U2.38 10.08,45.46 v19.86,55.24 | U4.4 92.53,53.9 v94.61,55.99 93.59,55.99 R11.2
  Bottom 0.254: v19.86,55.24 20.15,55.53 94.16,55.53 v94.61,55.99
IO3_B4  (via drill 0.35)
  Top 0.254: 80.94,26.55 82.93,28.54 82.93,44.6 JP1.P$16
  Top 0.3: 80.94,26.55 80.58,26.55 v80.53,26.6 | U2.15 27.34,28.77 v29.49,26.62
  Bottom 0.3: v29.49,26.62 29.72,26.39 80.32,26.39 v80.53,26.6
IO4_G7  (via drill 0.35)
  Top 0.254: v84.73,33.48 85.43,34.18 JP1.P$21
  Top 0.3: U2.4 11.35,28.17 16.56,33.38 v17.63,33.38
  Bottom 0.3: v17.63,33.38 17.73,33.27 84.53,33.27 v84.73,33.48
IO5_G2  (via drill 0.35)
  Top 0.254: JP1.P$26 v87.93,29.67 | v87.93,29.67
  Top 0.3: U2.5 v12.62,28.32
  Bottom 0.3: v12.62,28.32 12.62,28.6 13.69,29.67 v87.93,29.67
IO6_G3  (via drill 0.35)
  Top 0.254: JP1.P$25 87.43,31.1 85.27,28.93 v85.24,28.93
  Top 0.3: U2.6 13.89,28.52 v14.02,28.65
  Bottom 0.3: v14.02,28.65 14.35,28.98 85.2,28.98 v85.24,28.93
IO7_G4  (via drill 0.35)
  Top 0.254: JP1.P$24 86.93,31.74 v85.65,30.45
  Top 0.3: v15.24,30.4 15.16,30.33 U2.7
  Bottom 0.3: v85.65,30.45 15.29,30.45 v15.24,30.4
IO8_B3  (via drill 0.35)
  Top 0.254: JP1.P$17 83.43,27.88 82.3,26.75
  Top 0.3: v21.56,28.17 21.51,28.12 U2.12 | 82.3,26.75 v82.24,26.75
  Bottom 0.3: v82.24,26.75 82.22,26.75 81.15,25.68 28.47,25.68 25.98,28.17 v21.56,28.17
IO9_B6  (via drill 0.35)
  Top 0.254: v78.99,28.07 81.92,31 81.92,44.61 81.93,44.6 JP1.P$14
  Top 0.3: U2.17 27.66,31.32 v30.84,28.14
  Bottom 0.3: v78.99,28.07 30.91,28.07 v30.84,28.14
IO10_TF_CS  (via drill 0.35)
  Top 0.3: v62.76,22.28 37.92,22.28 27.61,32.59 U2.18 | SD1.2 61.64,16.48 v62.48,17.32 62.48,18.97 R67.2
  Bottom 0.3: v62.76,22.28 62.76,17.6 v62.48,17.32
IO11_TF_SPI_MOSI/TP_DIN  (via drill 0.35)
  Top 0.254: v60.1,50.85 60.22,50.98 U41.14 | v22.22,42.24 21.92,41.94 | 21.92,41.94 | 21.92,41.94 21.92,36.4 24.45,33.87 U2.19 27.41,33.86 38.26,23.02 v60.5,23.02 v60.5,23.01
  Top 0.3: R23.2 61.09,17.6 v60.55,17.07 60.55,15.05 SD1.3
  Bottom 0.254: v60.1,50.85 57.72,50.85 50.94,44.07 24.05,44.07 v22.22,42.24
  Bottom 0.3: v60.55,17.07 60.55,23.01 v60.5,23.01
IO12_TF_CLK/TP_CLK  (via drill 0.35)
  Top 0.254: v64.16,50.9 62.81,52.25 U41.16 | U2.20 24.23,35.13 22.68,36.68 22.68,41.59 v23.64,42.55
  Top 0.3: U2.20 27.45,35.13 38.86,23.72 v58.32,23.72 | v58.34,16.79 SD1.5
  Bottom 0.254: v64.16,50.9 64.11,50.85 64.11,50.75 56.85,43.49 24.58,43.49 v23.64,42.55
  Bottom 0.3: v58.34,16.79 58.34,18.52 58.32,18.54 v58.32,23.72
IO13_TF_SPI_MISO/TP_OUT  (via drill 0.35)
  Top 0.254: v64.62,49.81 64.54,49.73 61.92,49.73 U41.12 | U2.21 25.53,36.42 24.13,36.42 23.72,36.83 v23.72,41.45
  Top 0.3: SD1.7 56.11,15.07 v56.11,16.89 56.08,16.89 55.22,17.75 R24.2 | U2.21 27.63,36.4 39.52,24.51 v56.08,24.51
  Bottom 0.254: v64.62,49.81 57.1,42.29 24.56,42.29 v23.72,41.45
  Bottom 0.3: v56.08,24.51 56.11,24.49 v56.11,16.89
IO14_R7  (via drill 0.35)
  Top 0.254: 88.57,34.11 88.57,39.98 89.43,40.84 JP1.P$29
  Top 0.3: v27.41,37.57 27.41,37.67 U2.22 | 88.57,34.11 v88.67,34.01
  Bottom 0.3: v88.67,34.01 85.37,37.31 27.66,37.31 v27.41,37.57
IO15_G5  (via drill 0.35)
  Top 0.254: JP1.P$23 86.43,32.41 v85.65,31.62
  Top 0.3: U2.8 16.46,26.8 16.46,31.22 v16.51,31.27
  Bottom 0.3: v85.65,31.62 85.39,31.37 16.61,31.37 v16.51,31.27
IO16_G6  (via drill 0.35)
  Top 0.254: JP1.P$22 85.93,33.13 v85.42,32.61
  Top 0.3: U2.9 17.7,32.26 v17.65,32.31
  Bottom 0.3: v85.42,32.61 85.09,32.28 17.68,32.28 v17.65,32.31
IO17_TXD1  (via drill 0.35)  (2 unrouted)
  Top 0.254: 90.07,64.8 90.07,61.43
  Top 0.3: U2.10 18.97,33.3 v14.63,37.64 | 59.92,62.31 59.92,64.8 v59.89,64.82 60.02,64.95 89.91,64.95 90.07,64.8
  Bottom 0.3: v14.63,37.64 12.06,40.21 12.06,55.73 21.16,64.82 v59.89,64.82
IO18_RXD1  (via drill 0.35)  (1 unrouted)
  Top 0.254: v57.84,64.08 57.86,64.06 J10.1 | J4.5 87.45,63.6 87.35,63.71
  Top 0.3: U2.11 20.24,33.25 v16.15,37.34
  Bottom 0.3: v16.15,37.34 12.73,40.77 12.73,55.04 21.77,64.08 v57.84,64.08 87.12,64.08 v87.43,63.78
IO19_I2S_MCLK  (via drill 0.35)
  Top 0.3: U2.13 22.78,25.42 22.2,24.84 v13.41,24.84 | v13.31,16.97 13.39,17.04 R12.2
  Bottom 0.3: v13.41,24.84 13.41,16.97 v13.31,16.97
IO20_I2S_SDIN  (via drill 0.35)
  Top 0.3: U2.14 24.05,25.09 22.71,23.75 14.86,23.75 v14.76,23.85 | R4.2 13.46,14.22 v13.33,14.35
  Bottom 0.3: v14.76,23.85 14.81,23.8 14.81,14.99 14.17,14.35 v13.33,14.35
IO21_R6  (via drill 0.35)
  Top 0.254: JP1.P$30 89.93,44.59 89.94,44.6 89.94,40.67 89.33,40.06 89.33,34.77 v89.35,34.75
  Top 0.3: U2.23 27.53,38.94 27.56,38.91 v27.56,38.81
  Bottom 0.3: v89.35,34.75 86.23,37.87 28.5,37.87 v27.56,38.81
IO35_I2S_BCLK  (via drill 0.35)
  Top 0.3: R19.2 11.79,15.65 v11.73,15.6 | v19.02,36.19 19.08,36.19 21.18,38.3 21.18,42.31 22.78,43.91 U2.28
  Bottom 0.3: v11.73,15.6 11.76,15.62 11.76,28.75 19.02,36.02 v19.02,36.19
IO36_TP_IRQ  (via drill 0.35)
  Top 0.254: v30.64,41.49 25.77,46.37 22.14,46.37 21.51,45.74 U2.29 | U41.11 65.23,49.07 v65.25,49.05 65.28,49.08 65.92,49.08 R30.1
  Bottom 0.254: 57.7,41.34 30.8,41.34 v30.64,41.49
  Bottom 0.3: v65.25,49.05 65.25,48.89 57.7,41.34
IO37_I2C_SDA
  Top 0.254: U2.30 20.24,47.65 25.27,52.68 33.1,52.68 34.14,53.72 34.14,55.73 R7.2 34.85,56.85 34.85,61.99 | J4.8 95.07,66.01 94.06,67.03 37.21,67.03 34.85,64.67 34.85,61.99 | 34.85,61.99 J7.2
IO38_I2C_SCL  (via drill 0.35)
  Top 0.254: J4.7 92.53,64.67 91.29,65.91 38.15,65.91 v38.11,65.95 | v33.38,65.99 32.81,65.43 32.81,61.47 | U2.31 18.93,44.82 18.93,47.39 28.31,56.77 R6.2
  Top 0.3: R6.2 32.81,56.85 32.81,61.47 J7.1
  Bottom 0.254: v33.38,65.99 33.45,65.91 38.07,65.91 v38.11,65.95
IO39_HSYNC  (via drill 0.35)
  Top 0.254: U2.32 17.7,42.14 v20.45,39.4 | v79.41,36.5 79.43,36.53 JP1.P$9
  Bottom 0.254: v20.45,39.4 22.55,39.4 25.31,36.64 79.28,36.64 v79.41,36.5
IO40_DE  (via drill 0.35)
  Top 0.254: U2.33 16.43,42.22 v19.05,39.6 | v77.5,35.66 78.08,36.25 78.08,37.01 78.43,37.36 JP1.P$7
  Bottom 0.254: v19.05,39.6 19.13,39.6 23.06,35.66 v77.5,35.66
IO41_VSYNC  (via drill 0.35)
  Top 0.254: JP1.P$8 78.93,37.15 78.71,36.92 78.71,35.4 v78.64,35.33 | U2.34 15.16,42.19 v17.6,39.75
  Bottom 0.254: v17.6,39.75 22.45,34.9 78.21,34.9 v78.64,35.33
IO42_CLK_DCLK  (via drill 0.35)
  Top 0.254: U2.35 13.89,42.67 v14.3,42.27
  Top 0.3: v75.01,48.18 75.56,48.74 R26.1
  Bottom 0.254: 14.3,42.09 15.7,40.69 67.51,40.69
  Bottom 0.3: v14.3,42.27 14.3,42.09 | 67.51,40.69 v75.01,48.18
IO45_R3  (via drill 0.35)
  Top 0.254: v30.76,39.93 32.54,39.93 R31.2 | JP1.P$33 91.43,37.45 v91.77,37.11
  Top 0.3: v30.76,39.93 27.92,42.77 U2.26
  Bottom 0.3: v91.77,37.11 91.77,38.43 90.27,39.93 v30.76,39.93
IO46_B5  (via drill 0.35)
  Top 0.254: v79.68,27.18 82.43,29.93 82.43,44.59 JP1.P$15
  Top 0.3: U2.16 27.48,30.05 v30.15,27.38
  Bottom 0.3: v30.15,27.38 30.38,27.15 79.65,27.15 v79.68,27.18
IO47_R5  (via drill 0.35)
  Top 0.254: v90.17,35.48 90.2,35.51 90.2,37.16 90.42,37.39 90.42,44.03 90.43,44.04 JP1.P$31
  Top 0.3: U2.24 27.43,40.21 28.9,38.73 v28.93,38.73
  Bottom 0.3: v90.17,35.48 90.17,36.14 87.86,38.46 29.21,38.46 v28.93,38.73
IO48_R4  (via drill 0.35)
  Top 0.254: JP1.P$32 90.93,44.58 90.95,44.59 90.95,36.35 v90.92,36.32
  Top 0.3: U2.25 27.53,41.48 29.59,39.42 v29.87,39.42
  Bottom 0.3: v90.92,36.32 90.92,37.64 89.47,39.09 30.2,39.09 v29.87,39.42
LCD_LEDA  (1 unrouted)
  Top 0.254: 93.8,48.15 D6.2
  Top 0.3: JP1.P$39 94.43,46.76 93.78,47.42
  Top 0.5: U4.5 90.98,53.85 90.98,53.04 91.24,52.78 93.47,52.78 94.13,53.44 C19.2 95.68,53.44 95.83,53.29 C21.2 94.11,51.79 93.8,51.49 93.8,48.15
LCD_LEDK  (via drill 0.35)  (1 unrouted)
  Top 0.35: 94.98,44.79 95.86,45.67
  Top 0.5: 95.86,45.67 95.86,50.44 R29.1 94.79,50.47 v94.74,50.42 | v92.84,51.89 92.84,51.74 92.31,51.74 U4.3
  Bottom 0.5: v94.74,50.42 94.31,50.42 v92.84,51.89
LRCLK
  Top 0.3: U11.2 16.66,16.97 R12.1
N$1
  Top 0.3: R3.1 116.36,25.02 LED1.+
N$2
  Top 0.254: R41.2 53.47,46.81 55.09,48.44 U41.7
N$3
  Top 0.5: U11.8 29.29,18.24 C37.2
N$4
  cutout Top: 61.06,18.95 64.21,18.95 64.21,18.75 61.06,18.75
  cutout Top: 53.31,19.13 55.6,19.13 55.6,18.85 53.31,18.85
  cutout Top: 87.17,43.76 90.32,43.76 90.32,42.19 87.17,42.19
  cutout Top: 88.6,38.66 88.6,42.49 88.8,42.49 88.77,38.66 88.8,38.66
  cutout Top: 88.32,38.71 88.32,42.55 88.52,42.55 88.49,38.71 88.52,38.71
  cutout Top: 52.48,48.23 52.48,52.07 52.68,52.07 52.65,48.23 52.68,48.23
N$6
  Top 0.5: C14.1 C37.1 32.17,16.88 32.17,8.1 J5.P$2
N$7
  Top 0.3: JP1.P$10 79.93,45.52 79.45,46 79.45,46.91 R25.2
N$9
  Top 0.254: R2.2 R1.2 60.35,55.09 60.35,52.12 60.86,51.61 U41.15
N$10
  Top 0.5: C38.1 C16.1 30.84,12.04 29.99,11.19 J5.P$1
N$11
  Top 0.3: J3.A5 109.07,34.59 R13.2
N$12
  Top 0.5: U11.5 27.51,14.43 27.94,14.86 C38.2
N$13  (1 unrouted)
  Top 0.8: 83.11,7.01 83.06,7.06 83.06,11 84.04,11.98 U1.3
N$16  (1 unrouted)
  Top 0.8: L5.2 85.66,51.3 U4.1 89.96,51.28 89.96,47.89 88.9,46.84
N$17
  Top 0.3: J3.B5 109.21,37.59 R14.1
N$20
  Top 0.5: R20.2 80.35,14.84 | 80.35,14.84 R21.1 | U1.5 81.35,14.84 80.35,14.84
N$23
  Top 0.254: R58.2 R11.1
  Top 0.8: Q5.1 89.65,55.82 91.36,57.53 R11.1
N$36
  Top 0.8: Q30.1 81.7,56.01 R172.2 86.12,56.01 Q5.3
N$40
  Top 0.254: R72.2 104.54,52.91 U6.2
N$42
  Top 0.254: R71.2 104.4,51.64 U6.3
N$47
  Top 0.3: R16.2 64.06,16.89 62.74,15.57 SD1.1
N$48
  Top 0.3: SD1.8 55.04,16 53.82,17.22 R17.2
TP_X+
  Top 0.254: JP1.P$4 76.93,45.75 75.59,47.09 60.78,47.09 59.59,48.29 59.59,49.23 57.2,51.61 U41.2 56.01,51.56 54.46,51.56 53.49,52.53 C35.2
TP_X-
  Top 0.254: JP1.P$2 75.95,45.36 75.34,45.97 60.58,45.97 58.62,47.93 58.62,48.74 57.02,50.34 U41.4 54.18,50.34 53.49,49.66 C27.2
TP_Y+
  Top 0.254: JP1.P$3 76.43,45.56 75.56,46.43 61.47,46.43 61.44,46.46 60.77,46.46 59.13,48.1 59.13,49 57.15,50.98 U41.3 55.93,51.1 52.81,51.1 C28.2
TP_Y-
  Top 0.254: JP1.P$1 75.43,44.6 75.23,44.8 60.97,44.8 58.17,47.61 58.17,48.49 56.95,49.71 U41.5 54.86,49.71 53.39,48.23 C22.2
UART0_RXD0  (via drill 0.35)
  Top 0.254: v29.54,59.54 26.59,59.54 12.62,45.57 U2.36 | R72.1 102.73,53.25 v97.28,58.7
  Bottom 0.254: v97.28,58.7 96.37,59.61 29.54,59.61 v29.54,59.54
UART0_TXD0  (via drill 0.35)
  Top 0.254: R71.1 96.25,58.28 v96.29,58.32 | v24.1,58.17 24.1,58.12 11.35,45.36 U2.37
  Bottom 0.254: v96.29,58.32 95.94,58.67 24.61,58.67 v24.1,58.17
USB_D+
  Top 0.254: R9.2 105.13,36.88 104.6,37.41 104.6,39.22 109.88,44.5 109.88,47.45 108.22,49.1 U6.5
USB_D-
  Top 0.254: U6.6 107.66,47.83 108.85,46.64 108.85,44.71 103.62,39.48 103.62,36.74 104.92,35.44 R8.2
VBUS  (2 unrouted)
  Top 0.254: J3.B9 113.55,33.49 113.48,33.43 | J3.B9 113.62,33.59 113.77,33.44 | J3.A4 J3.B9
  Top 0.3: 98.4,6.61 D3.1 101.08,6.71 R15.2 102.99,6.85 103.92,7.77 U8.P$4
  Top 0.6: 114.62,38.24 113.75,38.24 | 113.77,33.44 114.63,33.44 | 113.48,33.43 111.89,33.43
  Top 0.65: 114.62,38.24 116.43,36.42 116.43,35.24 114.63,33.44
  Top 1: 98.4,6.61 102.62,6.61 103.49,7.47 106.58,7.47 107.47,8.36 107.47,29.01 111.89,33.43
VDD  (via drill 0.35)  (3 unrouted)
  Top 0.254: C25.1 36.73,18.14 36.7,18.11
  Top 0.3: U11.6 26.34,15.7
  Top 0.5: U11.6 27.2,15.7 28.12,16.61 v29.49,16.61 | 36.68,16.66 34.26,16.66 v34.24,16.64
  Top 1: 36.7,18.11 R18/NC.2
  Bottom 0.5: v29.49,16.61 29.51,16.59 34.19,16.59 v34.24,16.64
VIN  (via drill 0.35, 0.5)  (2 unrouted)
  Top 0.203: 93.36,10.34 C6.2 | 84.15,15.52 U1.4
  Top 0.3: U8.P$2 U8.P$3 | C6.2 93.4,10.37 95.2,10.37
  Top 0.5: U1.1 82.14,13.73 U1.4
  Top 0.8: v95.22,57.78 95.4,57.78 101.05,52.14 101.05,16.62 98.3,13.87 D3.2 | Q30.2 82.79,57.72 v82.83,57.76 83.95,57.76 R172.1
  Top 1: U8.P$3 U8.P$1 98.43,11.58 D3.2 96.97,10.37 92.63,10.37 88.37,14.64 v88.37,14.72 87.45,15.63 U1.4 | v45.82,13.77 45.69,13.64 R18/NC.1
  Bottom 0.8: v95.22,57.78 82.85,57.78 v82.83,57.76
  Bottom 1: v45.82,13.77 46.94,14.88 88.2,14.88 v88.37,14.72
VIN2
  Top 0.254: C43.2 80.42,53.52 C18.2
  Top 0.8: U4.6 L5.1 85.1,53.57 C18.2 79.11,54.82 79.11,56.62 Q30.3

### Text on the board
tPlace: www.elecrow.com | V1.1
tNames: IO18-RX1 | IO17-TX1 | 3V3 | GND | 3V3 | 3V3 | IO38 | IO37 | 3V3 | GND | GND | GND | IO18-RX1 | IO17-TX1 | IO38 | IO37 | IO0_TP_CS | IO12_TP_CLK | IO11_TP_DIN | IO13_TP_OUT | IO36_TP_IRQ | - | + | I2S-CTRL | IO19-I2S-LRCLK | IO35-I2S-BCLK | VON- | VOP+ | IO20-I2S-SDIN
tStop: Wizee-ESP32 | WZ4827R043